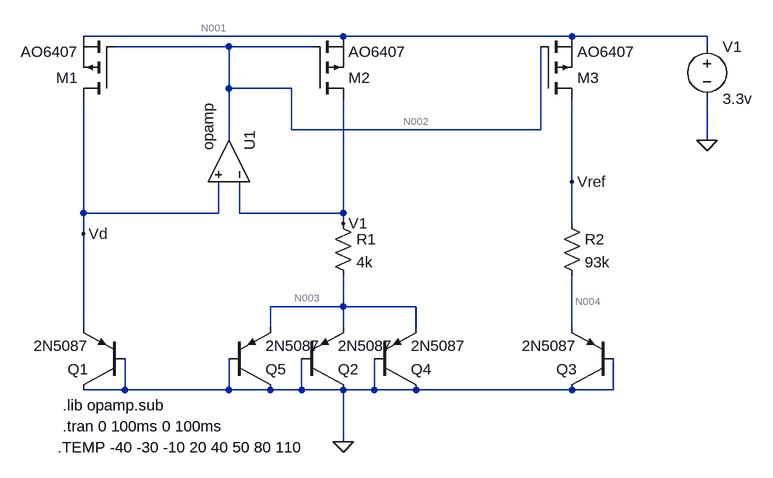
[diagram p0: schematic BGR.asc]
BGR.asc, the LTspice schematic file:
Version 4
SHEET 1 1068 728
WIRE 432 16 32 16
WIRE 784 16 432 16
WIRE 992 16 784 16
WIRE 256 32 80 32
WIRE 384 32 256 32
WIRE 992 32 992 16
WIRE 256 96 256 32
WIRE 352 96 256 96
WIRE 352 160 352 96
WIRE 736 160 736 32
WIRE 736 160 352 160
WIRE 256 176 256 96
WIRE 992 176 992 112
WIRE 784 240 784 112
WIRE 32 288 32 112
WIRE 240 288 240 240
WIRE 240 288 32 288
WIRE 272 288 272 240
WIRE 432 288 432 112
WIRE 432 288 272 288
WIRE 432 304 432 288
WIRE 784 304 784 240
WIRE 32 320 32 288
WIRE 432 432 432 384
WIRE 432 432 320 432
WIRE 544 432 432 432
WIRE 32 464 32 320
WIRE 320 464 320 432
WIRE 432 464 432 432
WIRE 544 464 544 432
WIRE 784 464 784 384
WIRE 96 560 96 512
WIRE 96 560 32 560
WIRE 256 560 256 512
WIRE 256 560 96 560
WIRE 320 560 256 560
WIRE 368 560 368 512
WIRE 368 560 320 560
WIRE 432 560 368 560
WIRE 480 560 480 512
WIRE 480 560 432 560
WIRE 544 560 480 560
WIRE 784 560 544 560
WIRE 848 560 848 512
WIRE 848 560 784 560
WIRE 432 640 432 560
FLAG 432 640 0
FLAG 992 176 0
FLAG 784 240 Vref
FLAG 432 304 V1
FLAG 32 320 Vd
SYMBOL Opamps\\opamp 320 208 M270
SYMATTR InstName U1
SYMBOL pnp 96 560 R180
SYMATTR InstName Q1
SYMATTR Value 2N5087
SYMBOL pnp 368 560 M180
SYMATTR InstName Q2
SYMATTR Value 2N5087
SYMBOL pnp 848 560 R180
SYMATTR InstName Q3
SYMATTR Value 2N5087
SYMBOL res 416 288 R0
SYMATTR InstName R1
SYMATTR Value 4k
SYMBOL res 768 288 R0
SYMATTR InstName R2
SYMATTR Value 93k
SYMBOL voltage 992 16 R0
SYMATTR InstName V1
SYMATTR Value 3.3v
SYMBOL pmos 80 112 R180
SYMATTR InstName M1
SYMATTR Value AO6407
SYMBOL pmos 384 112 M180
SYMATTR InstName M2
SYMATTR Value AO6407
SYMBOL pmos 736 112 M180
SYMATTR InstName M3
SYMATTR Value AO6407
SYMBOL pnp 480 560 M180
SYMATTR InstName Q4
SYMATTR Value 2N5087
SYMBOL pnp 256 560 M180
SYMATTR InstName Q5
SYMATTR Value 2N5087
TEXT 0 584 Left 2 !.lib opamp.sub
TEXT -8 648 Left 2 !.TEMP -40 -30 -10 20 40 50 80 110
TEXT 0 616 Left 2 !.tran 0 100ms 0 100ms

The netlist it stands for:
* BGR.asc
XU1 V1 Vd N002 opamp Aol=100K GBW=10Meg  ; pins invin noninvin out
Q1 0 0 Vd 0 2N5087
Q2 0 0 N003 0 2N5087
Q3 0 0 N004 0 2N5087
R1 V1 N003 4k
R2 Vref N004 93k
V1 N001 0 3.3v
M1 Vd N002 N001 N001 AO6407
M2 V1 N002 N001 N001 AO6407
M3 Vref N002 N001 N001 AO6407
Q4 0 0 N003 0 2N5087
Q5 0 0 N003 0 2N5087
.model NPN NPN
.model PNP PNP
.lib standard.bjt
.model NMOS NMOS
.model PMOS PMOS
.lib standard.mos
.lib opamp.sub
.TEMP -40 -30 -10 20 40 50 80 110
.tran 0 100ms 0 100ms
.backanno
.end

* Results of the author's LTspice run, read from the files saved beside the schematic
* Operating Point (first step), zero values left out:
*   temperature = -40 
*   V(n002) = 2.951 V
*   V(vd) = 675.2 mV
*   V(v1) = 675.2 mV
*   V(n003) = 653.1 mV
*   V(n004) = 675.2 mV
*   V(vref) = 1.188 V
*   V(n001) = 3.3 V
*   Ic(Q5) = -1.826 µA
*   Ib(Q5) = -11.18 nA
*   Ie(Q5) = 1.837 µA
*   Ic(Q4) = -1.826 µA
*   Ib(Q4) = -11.18 nA
*   Ie(Q4) = 1.837 µA
*   Ic(Q3) = -5.479 µA
*   Ib(Q3) = -32.79 nA
*   Ie(Q3) = 5.514 µA
*   Ic(Q2) = -1.826 µA
*   Ib(Q2) = -11.18 nA
*   Ie(Q2) = 1.837 µA
*   Ic(Q1) = -5.479 µA
*   Ib(Q1) = -32.79 nA
*   Ie(Q1) = 5.512 µA
*   Id(M3) = -5.512 µA
*   Is(M3) = 5.512 µA
*   Id(M2) = -5.512 µA
*   Is(M2) = 5.512 µA
*   Id(M1) = -5.512 µA
*   Is(M1) = 5.512 µA
*   I(R2) = 5.512 µA
*   I(R1) = 5.512 µA
*   I(V1) = -16.53 µA
*   Ix(u1:3) = -7.85 pA
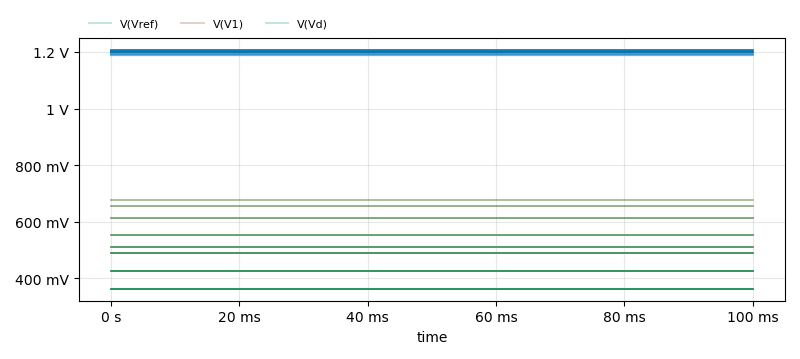
[diagram p1: Transient Analysis of BGR.asc, plotted from the saved traces]
* Transient Analysis, 8 runs:
*   V(Vref) [temp=-40°C]: min 1.188 V, max 1.188 V, average 1.188 V, rms 1.188 V, last 1.188 V
*   V(Vref) [temp=-30°C]: min 1.189 V, max 1.189 V, average 1.189 V, rms 1.189 V, last 1.189 V
*   V(Vref) [temp=-10°C]: min 1.192 V, max 1.192 V, average 1.192 V, rms 1.192 V, last 1.192 V
*   V(Vref) [temp=20°C]: min 1.196 V, max 1.196 V, average 1.196 V, rms 1.196 V, last 1.196 V
*   V(Vref) [temp=40°C]: min 1.199 V, max 1.199 V, average 1.199 V, rms 1.199 V, last 1.199 V
*   V(Vref) [temp=50°C]: min 1.2 V, max 1.2 V, average 1.2 V, rms 1.2 V, last 1.2 V
*   V(Vref) [temp=80°C]: min 1.203 V, max 1.203 V, average 1.203 V, rms 1.203 V, last 1.203 V
*   V(Vref) [temp=110°C]: min 1.205 V, max 1.205 V, average 1.205 V, rms 1.205 V, last 1.205 V
*   V(V1) [temp=-40°C]: min 675.2 mV, max 675.2 mV, average 675.2 mV, rms 675.2 mV, last 675.2 mV
*   V(V1) [temp=-30°C]: min 654.8 mV, max 654.8 mV, average 654.8 mV, rms 654.8 mV, last 654.8 mV
*   V(V1) [temp=-10°C]: min 613.8 mV, max 613.8 mV, average 613.8 mV, rms 613.8 mV, last 613.8 mV
*   V(V1) [temp=20°C]: min 551.8 mV, max 551.8 mV, average 551.8 mV, rms 551.8 mV, last 551.8 mV
*   V(V1) [temp=40°C]: min 510.1 mV, max 510.1 mV, average 510.1 mV, rms 510.1 mV, last 510.1 mV
*   V(V1) [temp=50°C]: min 489.2 mV, max 489.2 mV, average 489.2 mV, rms 489.2 mV, last 489.2 mV
*   V(V1) [temp=80°C]: min 426.2 mV, max 426.2 mV, average 426.2 mV, rms 426.2 mV, last 426.2 mV
*   V(V1) [temp=110°C]: min 362.8 mV, max 362.8 mV, average 362.8 mV, rms 362.8 mV, last 362.8 mV
*   V(Vd) [temp=-40°C]: min 675.2 mV, max 675.2 mV, average 675.2 mV, rms 675.2 mV, last 675.2 mV
*   V(Vd) [temp=-30°C]: min 654.8 mV, max 654.8 mV, average 654.8 mV, rms 654.8 mV, last 654.8 mV
*   V(Vd) [temp=-10°C]: min 613.8 mV, max 613.8 mV, average 613.8 mV, rms 613.8 mV, last 613.8 mV
*   V(Vd) [temp=20°C]: min 551.8 mV, max 551.8 mV, average 551.8 mV, rms 551.8 mV, last 551.8 mV
*   V(Vd) [temp=40°C]: min 510.2 mV, max 510.2 mV, average 510.2 mV, rms 510.2 mV, last 510.2 mV
*   V(Vd) [temp=50°C]: min 489.3 mV, max 489.3 mV, average 489.3 mV, rms 489.3 mV, last 489.3 mV
*   V(Vd) [temp=80°C]: min 426.3 mV, max 426.3 mV, average 426.3 mV, rms 426.3 mV, last 426.3 mV
*   V(Vd) [temp=110°C]: min 362.8 mV, max 362.8 mV, average 362.8 mV, rms 362.8 mV, last 362.8 mV